# Altium project BackBoard_ISO.PrjPcb
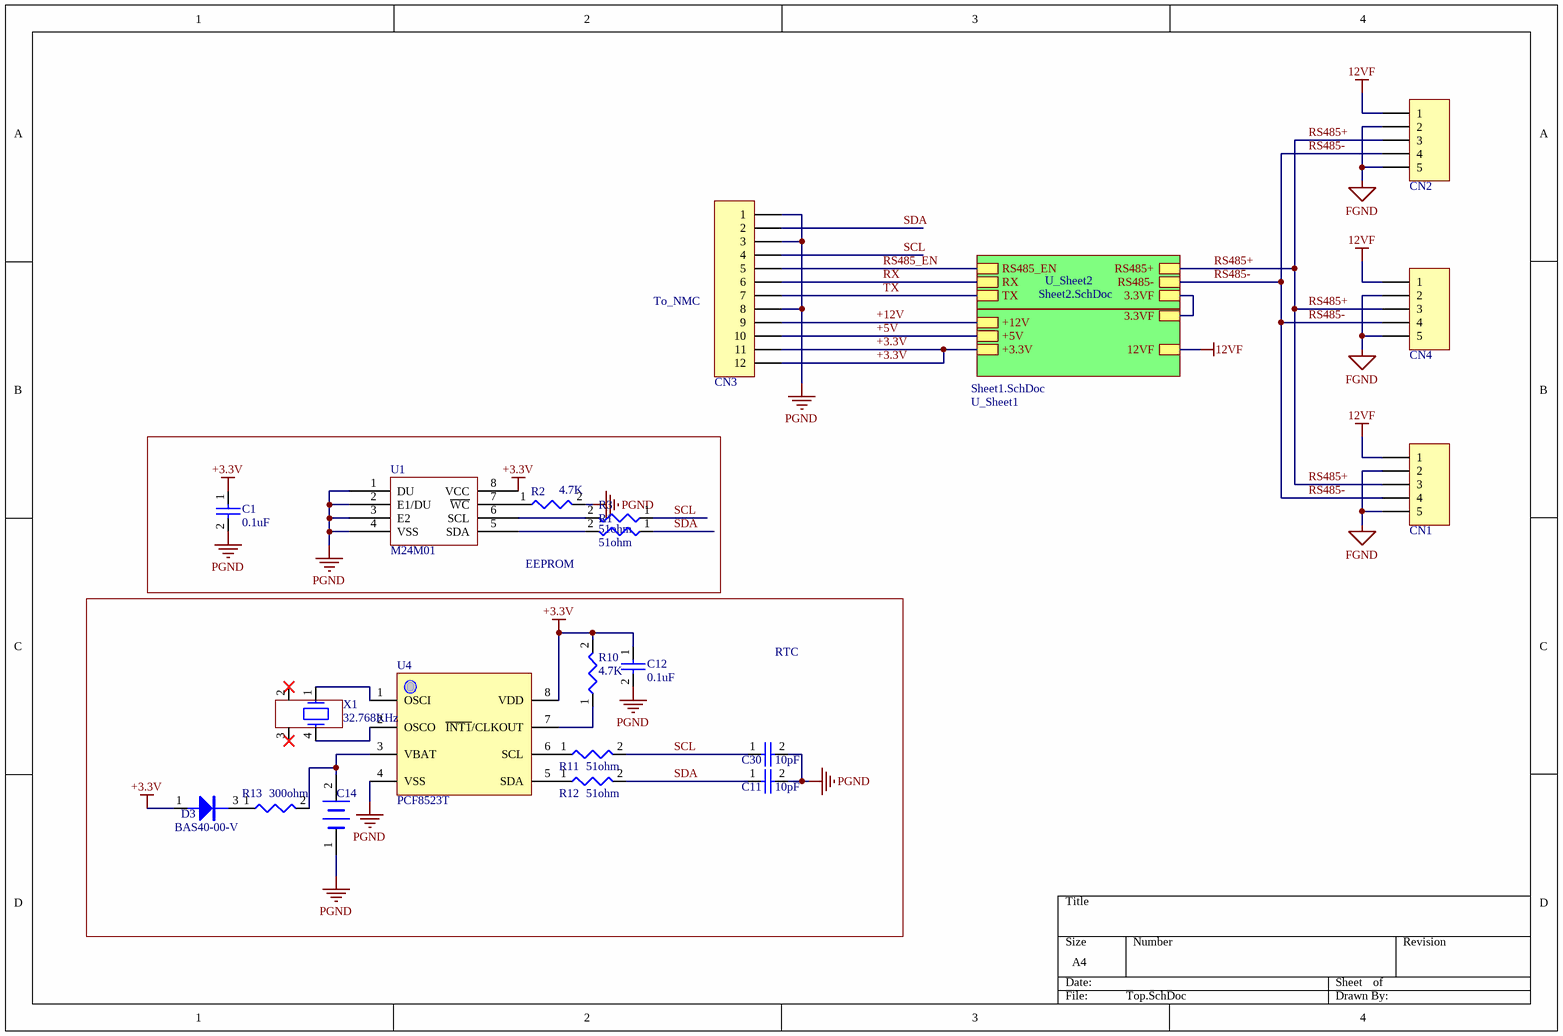
[diagram p0: Top.SchDoc]
PCBA P/N: PA00032; PCB P/N: PB10018A1; Project: BackBoard_AL
3 sheets, 59 parts. Net scope: hierarchical (ports join the sheet entries above them; power ports are global).
Board file: ISO_board.PcbDoc
Sheets:
  Top.SchDoc
    U_Sheet1 = Sheet1.SchDoc
    U_Sheet2 = Sheet2.SchDoc

## Sheet Top.SchDoc
size A4

### Parts
C1  value 0.1uF  [C0805]  (hidden comment: CAP)
C11  value 10pF  [C0805]  (hidden comment: CAP)
C12  value 0.1uF  [C0805]  (hidden comment: CAP)
C14  BATTERY  [DXJ_5R5H334U]  (value not drawn)
C30  value 10pF  [C0805]  (hidden comment: CAP)
CN1  Header 5  [70551-5P]  (value not drawn)
CN2  Header 5  [532590529]  (value not drawn)
CN3  Header 12  [353621276P2]  (value not drawn)
CN4  Header 5  [70551-5P]  (value not drawn)
D3  BAS40-00-V  [SOT23-123]
R1  value 51ohm  [R0805]  (hidden comment: RES)
R2  value 4.7K  [R0805]  (hidden comment: RES)
R3  value 51ohm  [R0805]  (hidden comment: RES)
R10  value 4.7K  [R0805]  (hidden comment: RES)
R11  value 51ohm  [R0805]  (hidden comment: RES)
R12  value 51ohm  [R0805]  (hidden comment: RES)
R13  value 300ohm  [R1206]  (hidden comment: RES)
U1  M24M01  [SOIC8]
U4  PCF8523T  [SO-8]
X1  value 32.768KHz  [MC306]  (hidden comment: MC306)

### Blocks framed on the sheet
EEPROM: C1 R1-R3 U1
RTC: C11 C12 C14 C30 D3 R10-R13 U4 X1

### Sub-sheets
U_Sheet1 = Sheet1.SchDoc: +3.3V, +5V, +12V, 12VF, 3.3VF
U_Sheet2 = Sheet2.SchDoc: RS485+, RS485-, RS485_EN, RX, TX, 3.3VF

### Nets
3.3VF: sheet U_Sheet1/3.3VF, sheet U_Sheet2/3.3VF
12VF: CN1.1 CN2.1 CN4.1 ; sheet U_Sheet1/12VF
+3.3V: C1.1 C12.1 CN3.11 CN3.12 D3.1 R10.2 U1.8(VCC) U4.8(VDD) ; sheet U_Sheet1/+3.3V
+5V: CN3.10 ; sheet U_Sheet1/+5V
+12V: CN3.9 ; sheet U_Sheet1/+12V
FGND: CN1.2 CN1.5 CN2.2 CN2.5 CN4.2 CN4.5
PGND: C1.2 C11.2 C12.2 C14.1(-) C30.2 CN3.1 CN3.3 CN3.8 R2.2 U1.1(DU) U1.2(E1/DU) U1.3(E2) U1.4(VSS) U4.4(VSS)
RS485+: CN1.3 CN2.3 CN4.3 ; sheet U_Sheet2/RS485+
RS485-: CN1.4 CN2.4 CN4.4 ; sheet U_Sheet2/RS485-
RS485_EN: CN3.5 ; sheet U_Sheet2/RS485_EN
RX: CN3.6 ; sheet U_Sheet2/RX
SCL: C30.1 CN3.4 R3.1 R11.2
SDA: C11.1 CN3.2 R1.1 R12.2
TX: CN3.7 ; sheet U_Sheet2/TX
NetC14_2: C14.2(+) R13.2 U4.3(VBAT)
NetD3_3: D3.3 R13.1
NetR1_2: R1.2 U1.5(SDA)
NetR2_1: R2.1 U1.7(~{WC})
NetR3_2: R3.2 U1.6(SCL)
NetR10_1: R10.1 U4.7(~{INT1}/CLKOUT)
NetR11_1: R11.1 U4.6(SCL)
NetR12_1: R12.1 U4.5(SDA)
NetU4_1: U4.1(OSCI) X1.1
NetU4_2: U4.2(OSCO) X1.4

Not connected (* = marked no-connect by the designer): X1 2* 3*

### Notes on the sheet
- To_NMC

### Library data of the parts
C1 C12 = EC00014: CAP SMD CR X7R 50V 10% 0.1uF 0805 ROHS; Manufacturer: YAGEO; Manufacturer P/N: CC0805KRX7R9BB104; ID: 14; HelpURL: *; P/N: EC00014
C11 C30 = EC00041: CAP SMD C0G 50V 10% 10pF 0805 ROHS; Manufacturer: YAGEO; Manufacturer P/N: CC0805JRNPO9BN100; ID: 41; HelpURL: *; P/N: EC00041
C14 = EC00046: CAP Super Capacitor,5.5V 0.33F 11.5X5MM ROHS; Manufacturer: ELNA; Manufacturer P/N: DXJ-5R5H334U; Value: 0.33F/5.5V; HelpU: \\192.168.1.3\Esh\Department\RD\CAD\Component\Capacitor\super cap\DXJ系列.pdf; ID: 46; Type: ****; P/N: EC00046
CN1 CN4 = EJ00030: CONNECTOR 5PIN,2.54PITCH,90 Degrees,PTH; Manufacturer: MOLEX; Value: 705510004; ID: 30; HelpURL: \\192.168.1.3\Esh\Department\RD\CAD\Component\connector\molex\705510004.pdf; P/N: EJ00030; Manufacturer P/N: 705510004
CN2 = EJ00018: CONNECTOR 5PIN,3.5PITCH,PTH,ROHS; Manufacturer: MOLEX; Value: 532590529; ID: 18; HelpURL: \\192.168.1.3\Esh\Department\RD\CAD\Component\connector\molex\532590529_sd.pdf; P/N: EJ00018; Manufacturer P/N: 532590529; Type: *****
CN3 = EJ00008: CONNECTOR 12PIN,2.00PITCH,PTH,2A,125V,ROHS,MATE_WITH:35507; Manufacturer: MOLEX; Value: 0353621276; ID: 8; HelpURL: \\192.168.1.3\Esh\Department\RD\CAD\Component\connector\molex\353621276_sd.pdf; P/N: EJ00008; Manufacturer P/N: 0353621276; Type: *****
D3 = ED00028: DIODE Schottky Diode 40V 0.2A SOT-23 SMD ROHS; Manufacturer: VISHAY; ID: 28; Type: ****; HelpURL: \\192.168.1.3\Esh\Department\RD\CAD\Component\DIODE\bas40v.pdf; P/N: ED00028; Manufacturer P/N: BAS40-00-V; Value: BAS40-00-V
R1 R3 R11 R12 = ER00085: RES THICK_FILM SMD 51 OHM 5% 1/8W ROHS 0805; Manufacturer: YAGEO; Manufacturer P/N: RC0805JR-0751RL; ID: 85; HelpURL: *; P/N: ER00085
R2 R10 = ER00039: RES THICK_FILM SMD 4.7K 5% 1/8W ROHS 0805; Manufacturer: YAGEO; Manufacturer P/N: RC0805JR-074K7L; ID: 39; HelpURL: *; P/N: ER00039
R13 = ER00017: RES THICK_FILM SMD 300 OHM 1% 1/4W ROHS 1206; Manufacturer: YAGEO; Manufacturer P/N: RC1206FR-07300RL; ID: 17; HelpURL: *; P/N: ER00017
U1 = EU00047: IC 1-Mbit serial I2C bus EEPROM; Manufacturer P/N: M24M01-RMN6TP; Manufacturer: ST; ID: 47; Value: M24M01-RMN6TP; HelpURL: \\192.168.1.3\Esh\Department\RD\CAD\Component\EEPROM\M24M01-RMN6TP.pdf; P/N: EU00047; Type: *****
U4 = EU00044: IC Real-Time Clock (RTC) and calendar,SO8，ROHS; Manufacturer P/N: PCF8523T/1; Manufacturer: NXP; ID: 44; Value: PCF8523T/1; HelpURL: \\192.168.1.3\Esh\Department\RD\CAD\Component\RTC\PCF8523.pdf; P/N: EU00044; Type: *****
X1 = EX00004: XTAL 8.0*3.8*2.5 32.768KHZ 6PF, +/-20PPM,SMD ROHS; Manufacturer: Atop Electronic Technology Co.,Ltd.; Manufacturer P/N: AX8038-32.768K-6P2030C; ID: 4; HelpURL: \\192.168.1.3\Esh\Department\RD\CAD\Component\Crystal\AX8038-32.768K-6P2030C.pdf; P/N: EX00004; Type: *****

## Sheet Sheet1.SchDoc
size A4
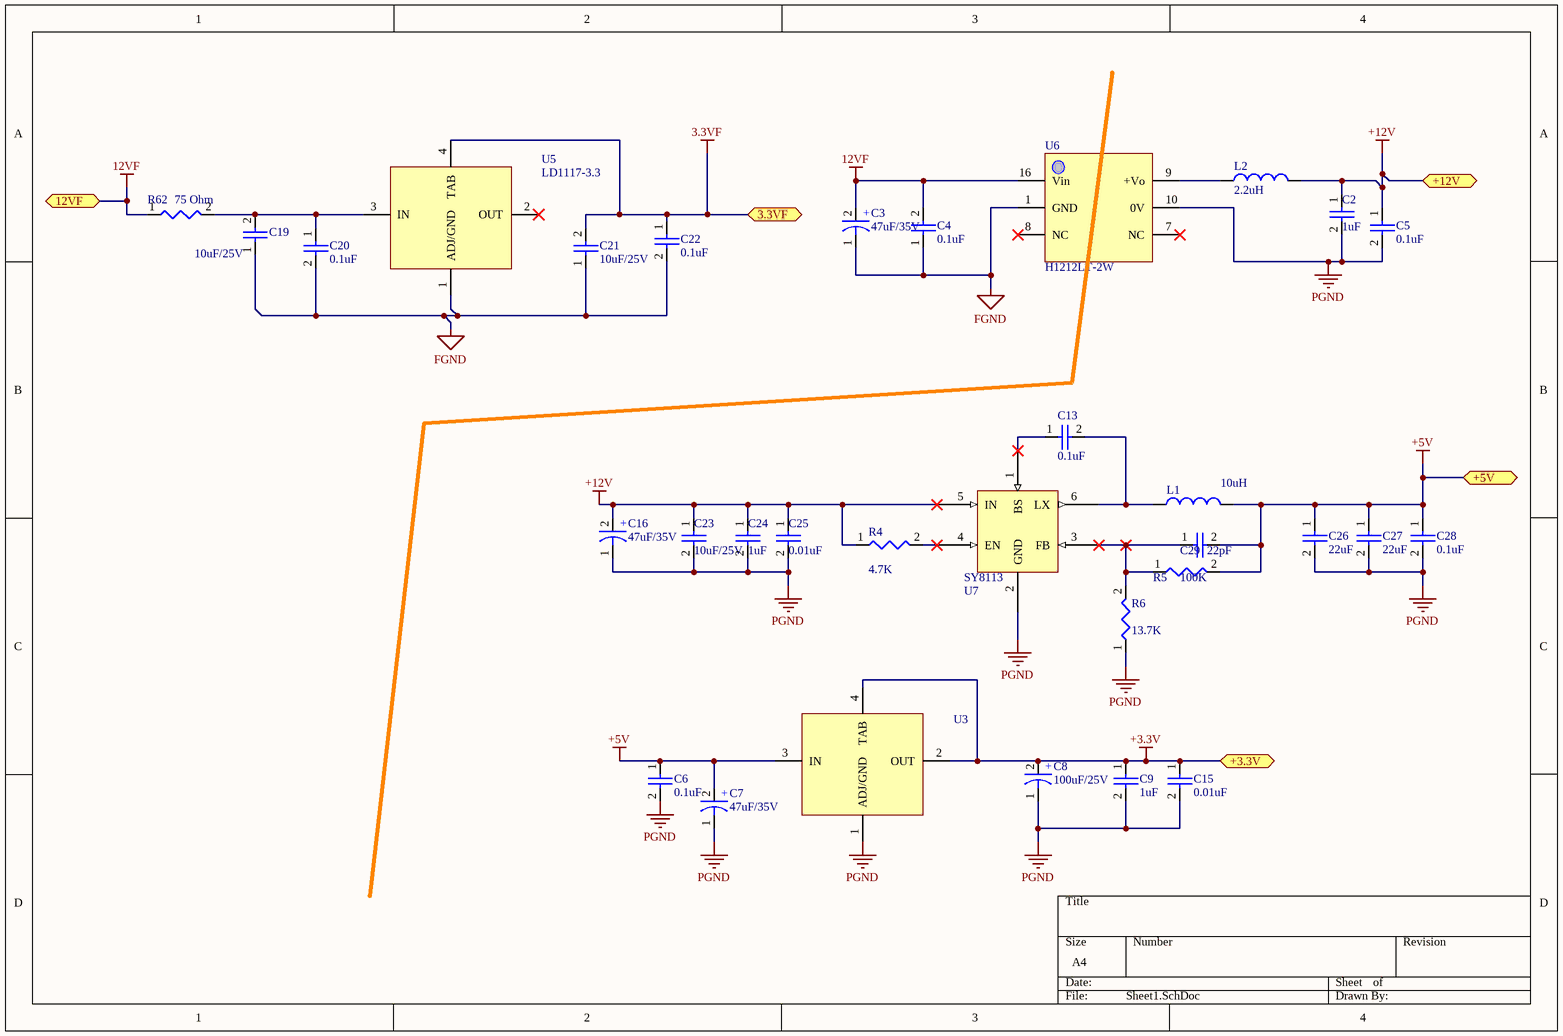
[diagram p1: Sheet1.SchDoc]

### Parts
C2  value 1uF  [C0805]  (hidden comment: CAP)
C3  value 47uF/35V  [CA6_6x5_8]  (hidden comment: CAPACITOR)
C4  value 0.1uF  [C0603]  (hidden comment: CAP)
C5  value 0.1uF  [C0603]  (hidden comment: CAP)
C6  value 0.1uF  [C0805]  (hidden comment: CAP)
C7  value 47uF/35V  [CA6_6x5_8]  (hidden comment: CAPACITOR)
C8  value 100uF/25V  [CA6_6x7_7]  (hidden comment: CAPACITOR)
C9  value 1uF  [C0805]  (hidden comment: CAP)
C13  value 0.1uF  [C0603]  (hidden comment: CAP)
C15  value 0.01uF  [C0805]  (hidden comment: CAP)
C16  value 47uF/35V  [CA6_6x5_8]  (hidden comment: CAPACITOR)
C19  value 10uF/25V  [C1206]  (hidden comment: CAP)
C20  value 0.1uF  [C0805]  (hidden comment: CAP)
C21  value 10uF/25V  [C1206]  (hidden comment: CAP)
C22  value 0.1uF  [C0805]  (hidden comment: CAP)
C23  value 10uF/25V  [C1206]  (hidden comment: CAP)
C24  value 1uF  [C0805]  (hidden comment: CAP)
C25  value 0.01uF  [C0805]  (hidden comment: CAP)
C26  value 22uF  [C1210]  (hidden comment: CAP)
C27  value 22uF  [C1210]  (hidden comment: CAP)
C28  value 0.1uF  [C0603]  (hidden comment: CAP)
C29  value 22pF  [C0805]  (hidden comment: CAP)
L1  value 10uH  [1038]  (hidden comment: Inductor)
L2  value 2.2uH  [L0805]  (hidden comment: Inductor)
R4  value 4.7K  [R0603]  (hidden comment: RES)
R5  value 100K  [R0603]  (hidden comment: RES)
R6  value 13.7K  [R0603]  (hidden comment: RES)
R62  value 75 Ohm  [R2512]  (hidden comment: RES)
U3  LD1117-3.3  [AS1117]  (value not drawn)
U5  LD1117-3.3  [DPAK-134]
U6  H1212LT-2W  [H_LT-2W]
U7  SY8113  [TSOT23-6L]

### Ports
3.3VF, 12VF, +3.3V, +5V, +12V

### Nets
3.3VF: C21.2 C22.1 U5.4(TAB) ; port 3.3VF
12VF: C3.2 C4.2 R62.1 U6.16(Vin) ; port 12VF
+3.3V: C8.2 C9.1 C15.1 U3.2(OUT) U3.4(TAB) ; port +3.3V
+5V: C6.1 C7.2 C26.1 C27.1 C28.1 C29.2 L1.2 R5.2 U3.3(IN) ; port +5V
+12V: C2.1 C5.1 C16.2 C23.1 C24.1 C25.1 L2.2 R4.1 U7.5(IN) ; port +12V
FGND: C3.1 C4.1 C19.1 C20.2 C21.1 C22.2 U5.1(ADJ/GND) U6.1(GND)
PGND: C2.2 C5.2 C6.2 C7.1 C8.1 C9.2 C15.2 C16.1 C23.2 C24.2 C25.2 C26.2 C27.2 C28.2 R6.1 U3.1(ADJ/GND) U6.10(0V) U7.2(GND)
NetC13_1: C13.1 U7.1(BS)
NetC13_2: C13.2 L1.1 U7.6(LX)
NetC19_2: C19.2 C20.1 R62.2 U5.3(IN)
NetC29_1: C29.1 R5.1 R6.2 U7.3(FB)
NetL2_1: L2.1 U6.9(+Vo)
NetR4_2: R4.2 U7.4(EN)

Not connected (* = marked no-connect by the designer): U5 2(OUT)*; U6 7(NC)* 8(NC)*

### Notes on the sheet
- (in symbol EC00073) +
- (in symbol EC00074) +

### Library data of the parts
C2 C9 C24 = EC00002: CAP SMD CR X7R 50V 10% 1uF 0805 ROHS; Manufacturer: YAGEO; Manufacturer P/N: CC0805KKX7R9BB105; ID: 2; HelpURL: *; P/N: EC00002
C3 C7 C16 = EC00074: CAP SMD AL 35V 20% 47uF Low_ESR F61 ROHS; Manufacturer: NIPPON CHEMI-CON; Manufacturer P/N: EMZJ350ADA470MF61G; ID: 74; Type: ****; HelpURL: \\192.168.1.3\Esh\Department\RD\CAD\Component\Capacitor\smd\nippon_al-mzj-c-111201.pdf; P/N: EC00074
C4 C5 C13 C28 = EC00093: CAP SMD XR7 50V 10% 100nF 0603 ROHS; Manufacturer: YAGEO; Manufacturer P/N: CC0603KRX7R9BB104; ID: 93; HelpURL: *; P/N: EC00093
C6 C20 C22 = EC00014: as C1 on sheet Top; HelpURL: *; P/N: EC00014
C8 = EC00073: CAP SMD AL 25V 20% 100uF Low_ESR F80 ROHS; Manufacturer: NIPPON CHEMI-CON; Manufacturer P/N: EMZJ250ADA101MF80G; ID: 73; Type: ****; HelpURL: \\192.168.1.3\Esh\Department\RD\CAD\Component\Capacitor\smd\nippon_al-mzj-c-111201.pdf; P/N: EC00073
C15 C25 = EC00018: CAP SMD CR X7R 50V 10% 10nF 0805 ROHS; Manufacturer: Murata; Manufacturer P/N: GRM216R71H103KA01D; ID: 18; HelpURL: *; P/N: EC00018
C19 C21 C23 = EC00088: CAP,CMCC,10uF,25V,10%,X7R,1206,SMD,ROHS; Manufacturer: Murata; Manufacturer P/N: GRM31CR71E106KA12L; ID: 88; Type: ****; HelpURL: \\192.168.1.3\Esh\Department\RD\CAD\Component\Capacitor\smd\Murata_GRM31CR71E106KA12L.pdf; P/N: EC00088
C26 C27 = EC00124: CAP SMD MLCC X7R 16V 22uF 20% 1210 ROHS; Manufacturer: Murata; Manufacturer P/N: GRM32ER71C226MEA8#; ID: 124; Type: ****; HelpURL: *; P/N: EC00124
C29 = EC00015: CAP SMD C0G 50V 10% 22pF 0805 ROHS; Manufacturer: Murata; Manufacturer P/N: GQM2195C1H220JB01B; ID: 15; HelpURL: *; P/N: EC00015
L1 = EL00022: INDUCTOR 10uH 3.6A 30% SMD 1038 ROHS; Manufacturer: Wuerth Electronic; Manufacturer P/N: 744066100; ID: 22; HelpURL: http://katalog.we-online.de/pbs/datasheet/744066100.pdf; P/N: EL00022
L2 = EL00005: INDUCTOR 2.2uH 0.5A 20% SMD 0805 ROHS; Manufacturer: Wuerth Electronic; Manufacturer P/N: 74479775222; ID: 5; Type: ****; HelpURL: \\192.168.1.3\Esh\Department\RD\CAD\Component\Inductor\WE_74479775222.pdf; P/N: EL00005
R4 = ER00176: RES THICK_FILM 4.7K 5% 1/10W ROHS 0603; Manufacturer: YAGEO; Manufacturer P/N: RC0603JR-074K7L; ID: 176; HelpURL: \\192.168.1.3\Esh\Department\RD\CAD\Component\Resistor\Leaded-R_MFR_2011.pdf; P/N: ER00176
R5 = ER00221: RES,THIN_FILM,100K,1%	,1/16W,±50ppm/℃,ROHS,0603,SMD; Manufacturer: VIKING; Manufacturer P/N: AR03FTDY1003; ID: 221; HelpURL: *; P/N: ER00221
R6 = ER00220: RES,THIN_FILM,13.7K,1%	,1/16W,±50ppm/℃,ROHS,0603,SMD; Manufacturer: VIKING; Manufacturer P/N: AR03FTDY1372; ID: 220; HelpURL: *; P/N: ER00220
R62 = ER00212: RES THICK_FILM SMD 75 ohm 5% 1W ROHS 2512; Manufacturer: YAGEO; Manufacturer P/N: RC2512JK-0775RL; ID: 212; HelpURL: \\192.168.1.3\Esh\Department\RD\CAD\Component\Resistor\SMD\YAGEO_PYu-RC1206_51_RoHS_L_4.pdf; P/N: ER00212
U3 = EU00006: IC REG VOLT +3.3V LDO 800MA SOT223 ROHS; Manufacturer: ST; Manufacturer P/N: LD1117S33CTR; ID: 6; HelpURL: \\192.168.1.3\Esh\Department\RD\CAD\Component\Power_DC_to_DC\LD1117_ST.pdf; Value: LD1117-3.3; P/N: EU00006; Type: *****
U5 = EU00066: IC REG VOLT +3.3V LDO 800MA DPAK ROHS; Manufacturer P/N: LD1117DT33TR; Manufacturer: ST; ID: 66; HelpURL: \\192.168.1.3\Esh\Department\RD\CAD\Component\Power_DC_to_DC\LD1117_ST.pdf; P/N: EU00066; Value: LD1117-3.3; Type: *****
U6 = EU00069: IC DC/DC,12V->12V,2W,ISOLATION:6000VDC,23.86X18.10X8MM,ROHS; Manufacturer: Mornsun; ID: 69; HelpURL: \\192.168.1.3\Esh\Department\RD\CAD\Component\Power_DC_to_DC\Isolated\H_RN-2W & H_LT-2W_CN.pdf; P/N: EU00069; Manufacturer P/N: H1212LT-2W; Value: H1212LT-2W; Type: *****
U7 = EU00068: Regulator,500KHz,3A,18V Input,Synchronous Step Down,TSOT23-6; Manufacturer P/N: SY8113ADC; Manufacturer: SILERGY; ID: 68; Value: SY8113ADC; HelpURL: \\192.168.1.3\Esh\Department\RD\CAD\Component\Power_DC_to_DC\AN_SY8113_Internal_cee.pdf; P/N: EU00068; Type: *****

## Sheet Sheet2.SchDoc
size A4
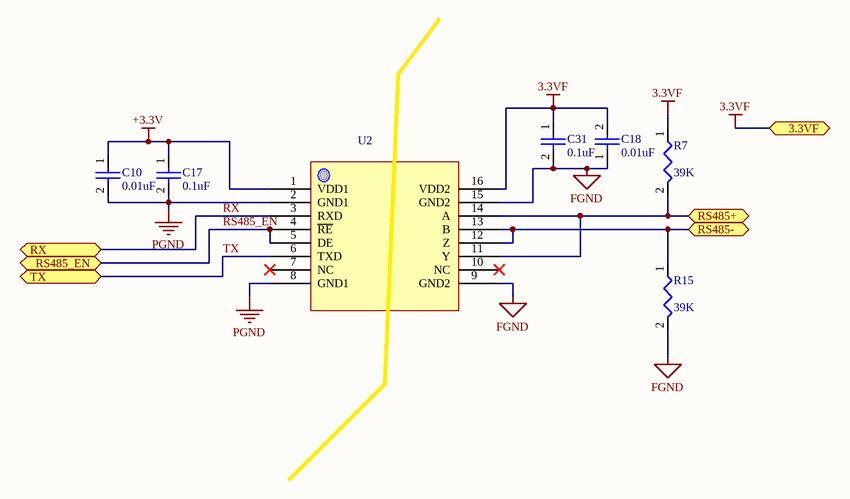
[diagram p2: Sheet2.SchDoc]

### Parts
C10  value 0.01uF  [C0805]  (hidden comment: CAP)
C17  value 0.1uF  [C0805]  (hidden comment: CAP)
C18  value 0.01uF  [C0805]  (hidden comment: CAP)
C31  value 0.1uF  [C0805]  (hidden comment: CAP)
R7  value 39K  [R0805]  (hidden comment: RES)
R15  value 39K  [R0805]  (hidden comment: RES)
U2  ADM2484E  [SOIC16]  (value not drawn)

### Ports
3.3VF, RS485+, RS485-, RS485_EN, RX, TX

### Nets
3.3VF: C18.2 C31.1 R7.1 U2.16(VDD2) ; port 3.3VF
+3.3V: C10.1 C17.1 U2.1(VDD1)
FGND: C18.1 C31.2 R15.2 U2.9(GND2) U2.15(GND2)
PGND: C10.2 C17.2 U2.2(GND1) U2.8(GND1)
RS485+: R7.2 U2.11(Y) U2.14(A) ; port RS485+
RS485-: R15.1 U2.12(Z) U2.13(B) ; port RS485-
RS485_EN: U2.4(~{RE}) U2.5(DE) ; port RS485_EN
RX: U2.3(RXD) ; port RX
TX: U2.6(TXD) ; port TX

Not connected (* = marked no-connect by the designer): U2 7(NC)* 10(NC)*

### Library data of the parts
C10 C18 = EC00037: CAP SMD X7R 50V 10% 10nF 0805 ROHS; Manufacturer: YAGEO; Manufacturer P/N: CC0805KRX7R9BB103; ID: 37; HelpURL: *; P/N: EC00037
C17 C31 = EC00014: as C1 on sheet Top; HelpURL: *; P/N: EC00014
R7 R15 = ER00021: RES THICK_FILM SMD 39K 5% 1/8W ROHS 0805; Manufacturer: YAGEO; Manufacturer P/N: RC0805JR-0739KL; ID: 21; HelpURL: *; P/N: ER00021
U2 = EU00059: IC Isolated, RS-485/RS-422 transceiver,5kV,SOIC16_W,ROHS; Manufacturer: Analog Devices; Manufacturer P/N: ADM2484EBRWZ-REEL7; Pin Number: 16; ID: 59; Value: ADM2484EBRWZ-REEL7; HelpURL: \\192.168.1.3\Esh\Department\RD\CAD\Component\RS485\ADM2484E.pdf; P/N: EU00059; Type: *****

## Nets that join several sheets
3.3VF: Sheet1 (C21.2 C22.1 U5.4), Sheet2 (C18.2 C31.1 R7.1 U2.16)
12VF: Top (CN1.1 CN2.1 CN4.1), Sheet1 (C3.2 C4.2 R62.1 U6.16)
+3.3V: Top (8 pins), Sheet1 (5 pins), Sheet2 (C10.1 C17.1 U2.1)
+5V: Top (CN3.10), Sheet1 (9 pins)
+12V: Top (CN3.9), Sheet1 (9 pins)
FGND: Top (6 pins), Sheet1 (8 pins), Sheet2 (5 pins)
PGND: Top (14 pins), Sheet1 (18 pins), Sheet2 (C10.2 C17.2 U2.2 U2.8)
RS485+: Top (CN1.3 CN2.3 CN4.3), Sheet2 (R7.2 U2.11 U2.14)
RS485-: Top (CN1.4 CN2.4 CN4.4), Sheet2 (R15.1 U2.12 U2.13)
RS485_EN: Top (CN3.5), Sheet2 (U2.4 U2.5)
RX: Top (CN3.6), Sheet2 (U2.3)
TX: Top (CN3.7), Sheet2 (U2.6)